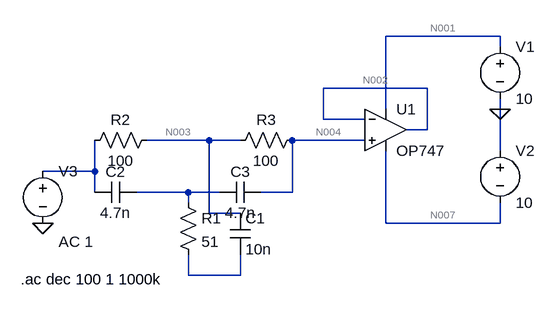
[diagram p0: schematic TWIN_T_NETOWORK.asc]
TWIN_T_NETOWORK.asc, the LTspice schematic file:
Version 4
SHEET 1 880 680
WIRE 384 0 208 0
WIRE 384 16 384 0
WIRE 272 80 112 80
WIRE 208 112 208 0
WIRE 384 112 384 96
WIRE 112 128 112 80
WIRE 176 128 112 128
WIRE 272 144 272 80
WIRE 272 144 240 144
WIRE -64 160 -160 160
WIRE -16 160 -64 160
WIRE 176 160 64 160
WIRE 384 176 384 112
WIRE -240 208 -240 160
WIRE -240 208 -320 208
WIRE -240 240 -240 208
WIRE -96 240 -176 240
WIRE -48 240 -96 240
WIRE 64 240 64 160
WIRE 64 240 16 240
WIRE -96 256 -96 240
WIRE -64 272 -64 160
WIRE -16 272 -64 272
WIRE 208 288 208 176
WIRE 384 288 384 256
WIRE 384 288 208 288
WIRE -96 368 -96 336
WIRE -16 368 -16 336
WIRE -16 368 -96 368
FLAG 384 112 0
FLAG -320 288 0
SYMBOL OpAmps\\OP747 208 80 R0
SYMATTR InstName U1
SYMBOL voltage 384 0 R0
WINDOW 123 0 0 Left 0
WINDOW 39 0 0 Left 0
SYMATTR InstName V1
SYMATTR Value 10
SYMBOL voltage 384 160 R0
WINDOW 123 0 0 Left 0
WINDOW 39 0 0 Left 0
SYMATTR InstName V2
SYMATTR Value 10
SYMBOL res -112 240 R0
SYMATTR InstName R1
SYMATTR Value 51
SYMBOL res -144 144 R90
WINDOW 0 0 56 VBottom 2
WINDOW 3 32 56 VTop 2
SYMATTR InstName R2
SYMATTR Value 100
SYMBOL res 80 144 R90
WINDOW 0 0 56 VBottom 2
WINDOW 3 32 56 VTop 2
SYMATTR InstName R3
SYMATTR Value 100
SYMBOL cap -32 272 R0
SYMATTR InstName C1
SYMATTR Value 10n
SYMBOL cap -176 224 R90
WINDOW 0 0 32 VBottom 2
WINDOW 3 32 32 VTop 2
SYMATTR InstName C2
SYMATTR Value 4.7n
SYMBOL cap 16 224 R90
WINDOW 0 0 32 VBottom 2
WINDOW 3 32 32 VTop 2
SYMATTR InstName C3
SYMATTR Value 4.7n
SYMBOL voltage -320 192 R0
WINDOW 123 24 124 Left 2
WINDOW 39 0 0 Left 0
SYMATTR InstName V3
SYMATTR Value ""
SYMATTR Value2 AC 1
TEXT -354 374 Left 2 !.ac dec 100 1 1000k

The netlist it stands for:
* TWIN_T_NETOWORK.asc
XU1 N004 N002 N001 N007 N002 OP747  ; pins In+ In- V+ V- OUT
V1 N001 0 10
V2 0 N007 10
R1 N006 N008 51
R2 N003 N005 100
R3 N004 N003 100
C1 N003 N008 10n
C2 N006 N005 4.7n
C3 N004 N006 4.7n
V3 N005 0 AC 1
.ac dec 100 1 1000k
.backanno
.end

* Results of the author's LTspice run, read from the files saved beside the schematic
* Operating Point, zero values left out:
*   V(n002) = 82.24 µV
*   V(n007) = -10 V
*   V(n001) = 10 V
*   V(n004) = 2.243 µV
*   V(n003) = 1.121 µV
*   I(R3) = 11.21 nA
*   I(R2) = 11.21 nA
*   I(V3) = 11.21 nA
*   I(V2) = -268.6 µA
*   I(V1) = -268.6 µA
*   Ix(u1:1) = -11.21 nA
*   Ix(u1:2) = -9.214 nA
*   Ix(u1:99) = 268.6 µA
*   Ix(u1:50) = -268.6 µA
*   Ix(u1:45) = 9.214 nA
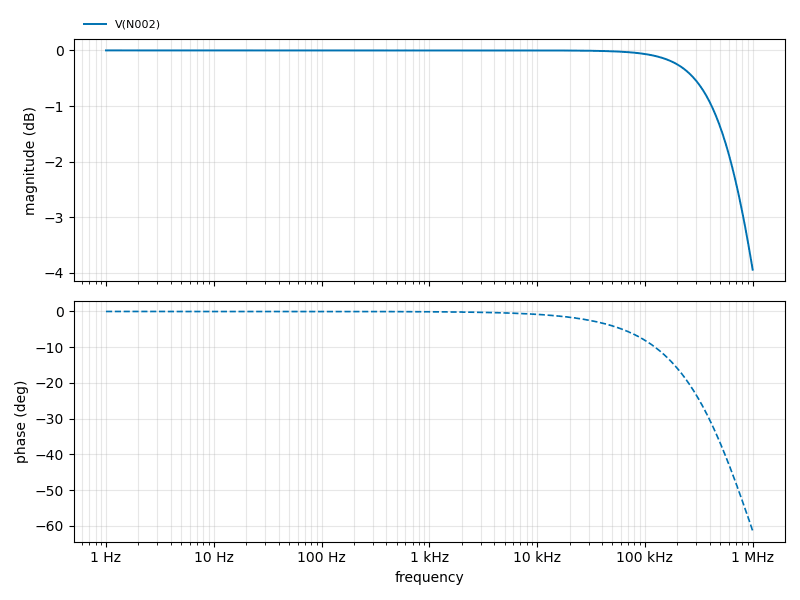
[diagram p1: AC Analysis of TWIN_T_NETOWORK.asc, plotted from the saved traces]
* AC Analysis, 1 run:
*   V(N002): 0.00 dB at 1 Hz, -3.94 dB at 1 MHz, peak 0.00 dB at 1 Hz, 3 dB below the peak at 820.8 kHz